# Altium schematic sheet Filter Capacitors - ADC Sensor.SchDoc: ADC Sensor Filter Capacitors
size A4; DocumentNumber: 42; SheetNumber: 42; SheetTotal: 54
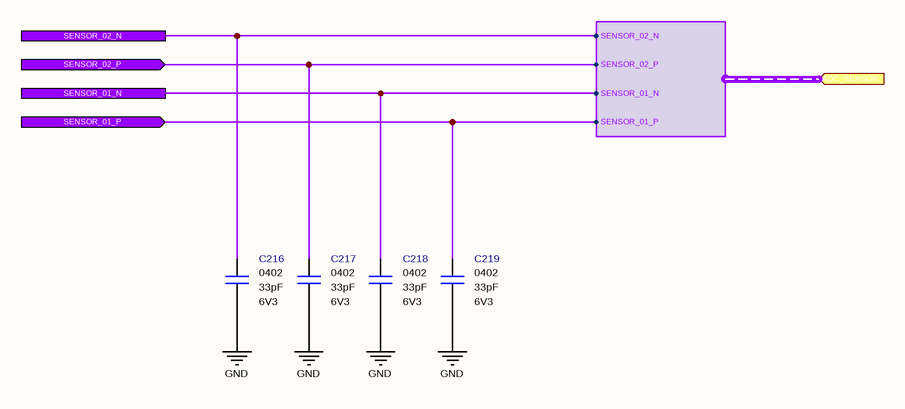
[diagram p0: Filter Capacitors - ADC Sensor.SchDoc]

## Parts
C216  value 33pF  Case: 0402  Voltage: 6V3  [CAPACITOR_0402]  (hidden comment: Multilayer Ceramic Capacitor)
C217  value 33pF  Case: 0402  Voltage: 6V3  [CAPACITOR_0402]  (hidden comment: Multilayer Ceramic Capacitor)
C218  value 33pF  Case: 0402  Voltage: 6V3  [CAPACITOR_0402]  (hidden comment: Multilayer Ceramic Capacitor)
C219  value 33pF  Case: 0402  Voltage: 6V3  [CAPACITOR_0402]  (hidden comment: Multilayer Ceramic Capacitor)

## Ports
ADC_SENSOR (in, harness ADC_SENSOR), SENSOR_01_N, SENSOR_01_P (in), SENSOR_02_N, SENSOR_02_P (in)

## Harnesses
ADC_SENSOR: SENSOR_01_P, SENSOR_01_N, SENSOR_02_P, SENSOR_02_N

## Nets
GND: C216.1 C217.1 C218.1 C219.1
SENSOR_01_N: C218.2 ; port SENSOR_01_N, port ADC_SENSOR.SENSOR_01_N
SENSOR_01_P: C219.2 ; port SENSOR_01_P, port ADC_SENSOR.SENSOR_01_P
SENSOR_02_N: C216.2 ; port SENSOR_02_N, port ADC_SENSOR.SENSOR_02_N
SENSOR_02_P: C217.2 ; port SENSOR_02_P, port ADC_SENSOR.SENSOR_02_P

## Notes on the sheet
- Engineer
- All Rights are reserved to Customer and Engineer. [2021]
- Size:
- Date:
- A4
- Project :
- Time:
- Sheet
- of
- Customer
- Product ID
- Module ID
- Version
- File:
- Revision

## Library data of the parts
C216-C219 = Capacitor - 33pF [0402-6V3]: Capacitor - 33pF [0402] (Ceramic); Manufacturer Name: Kemet; Manufacturer Part Number: C0402C330J9RACAUTO; Dielectric: X7R; Tolerance: 10%; Height: 0.5mm; Maximum Operating Temperature: +125; Minimum Operating Temperature: -55; ROHS: Yes; ComponentLink1Description: DataSheet; ComponentLink1URL: https://api.kemet.com/component-edge/download/datasheet/C0402C330J9RACAUTO.pdf; ComponentLink2Description: Mouser; ComponentLink2URL: https://www.mouser.com/Search/Refine.aspx?Keyword=80-C0402C330J9RAUTO; Supplier 1: Mouser; Supplier Part Number 1: 80-C0402C330J9RAUTO; Mouser Part Number: 80-C0402C330J9RAUTO